# Altium project PCB_Project.PrjPcb
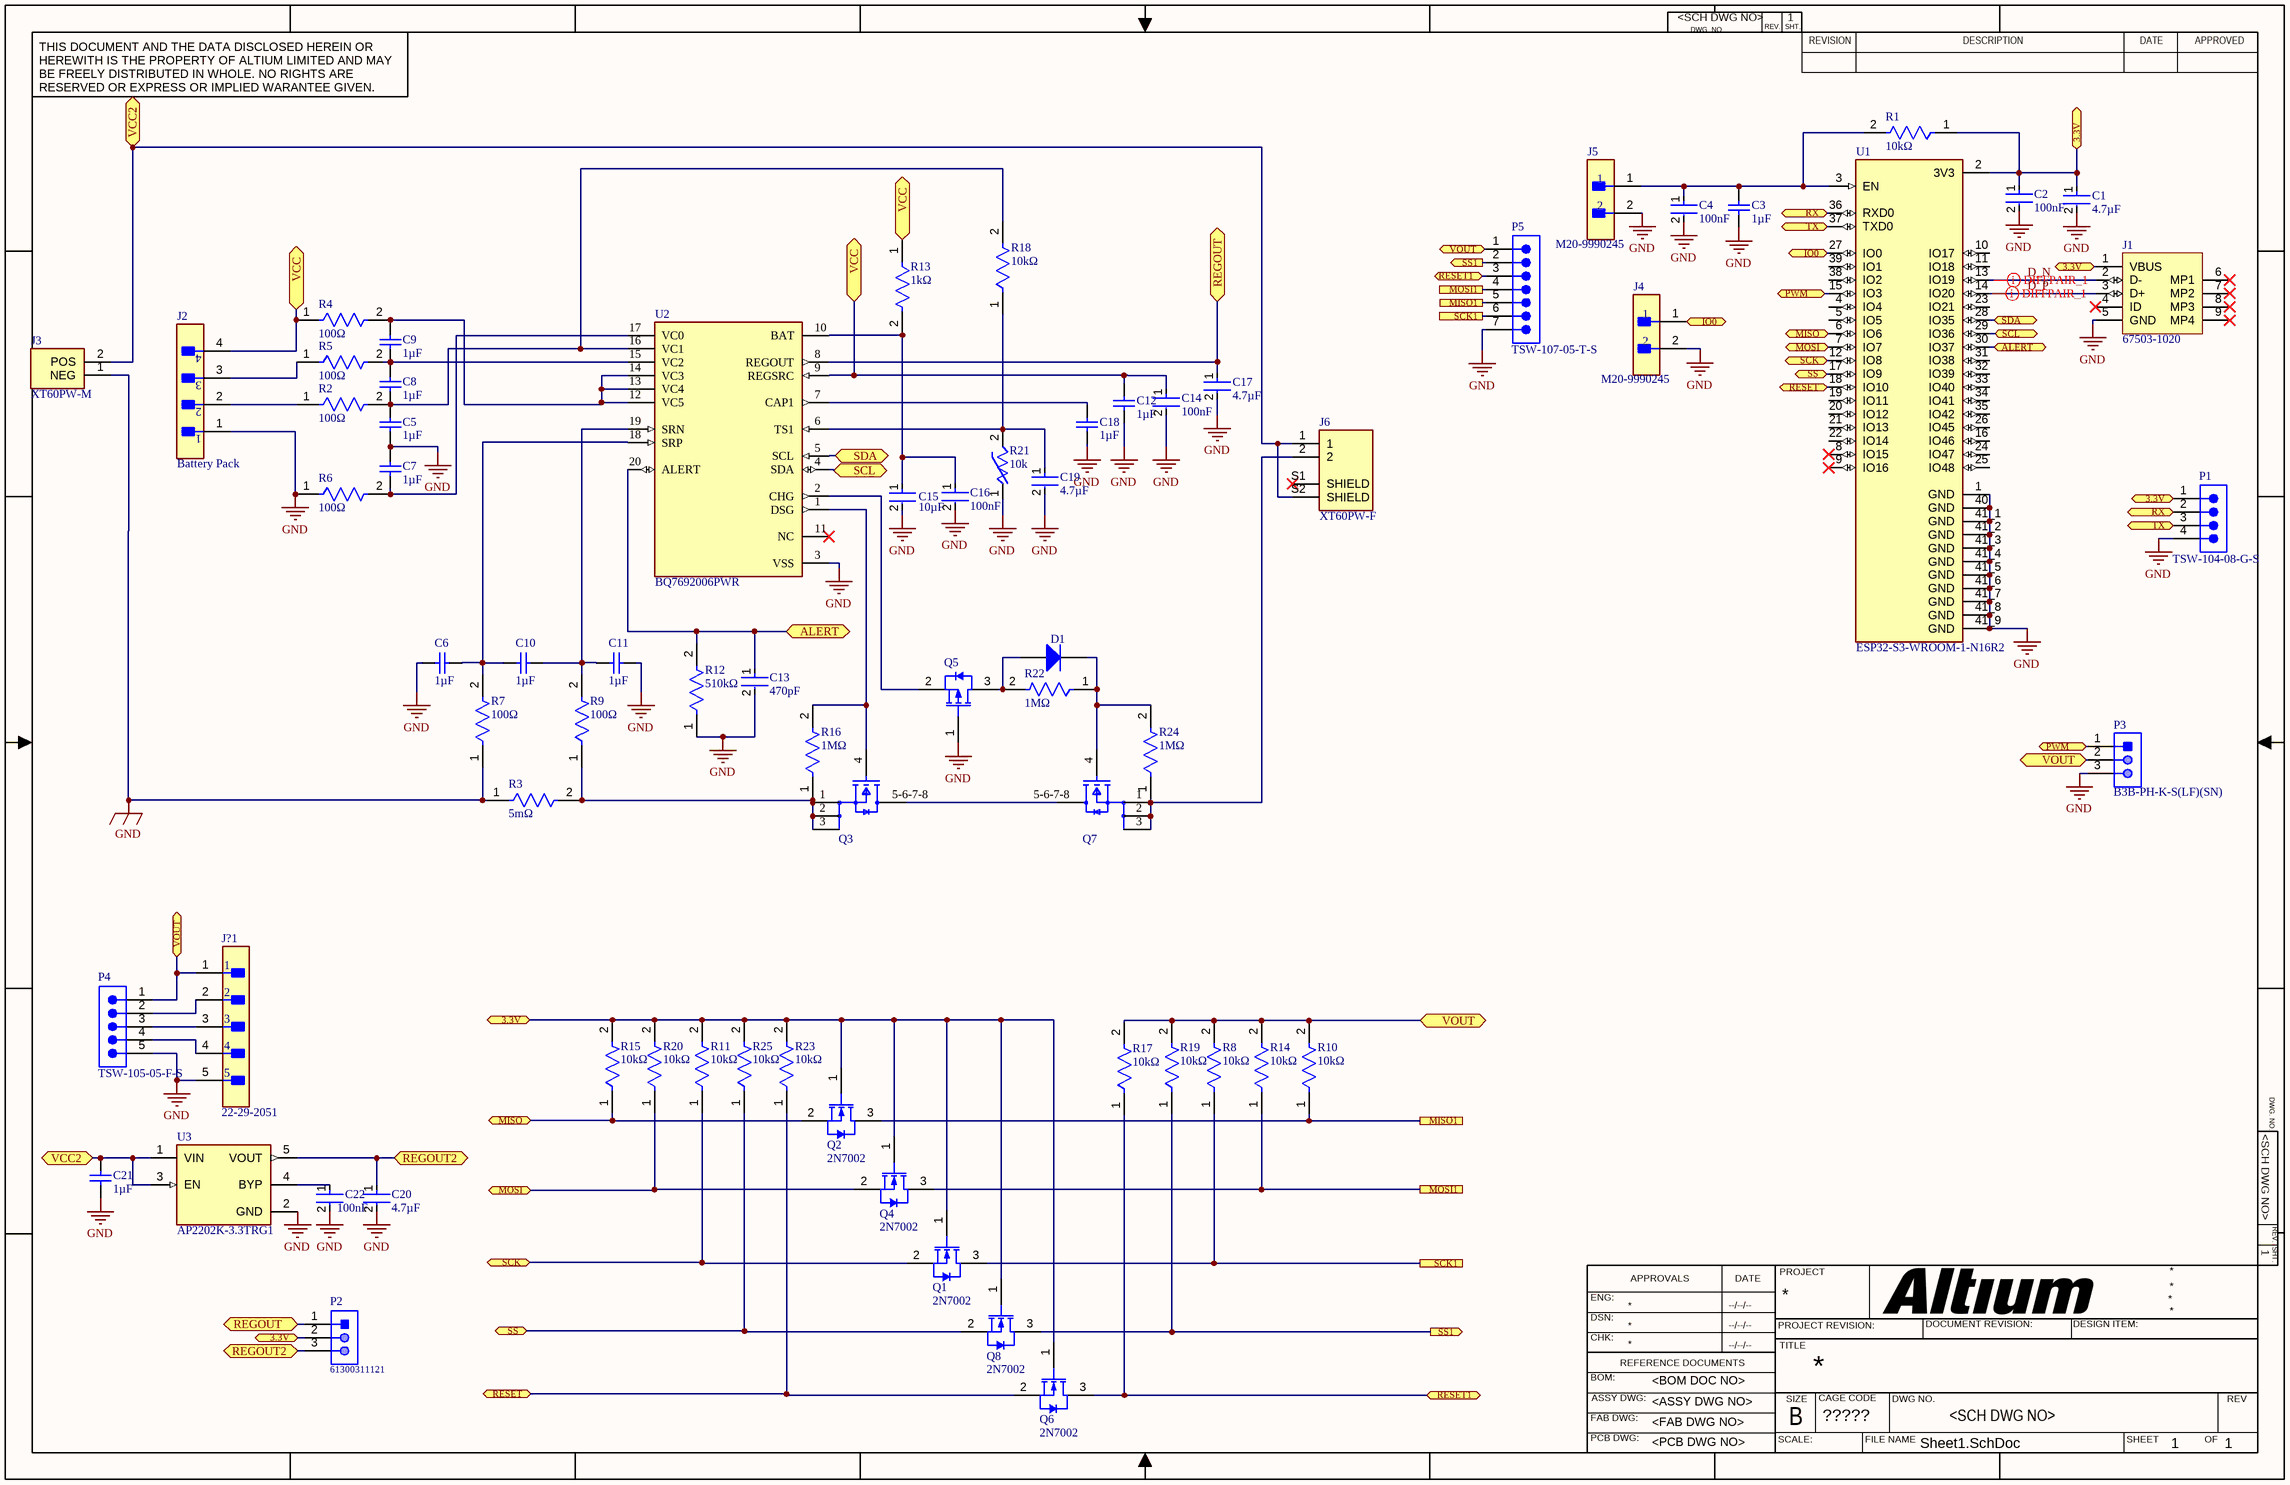
[diagram p0: Sheet1.SchDoc]
CAGE_CODE: ?????; CONTRACT_NUMBER: <CONTRACT NO>; DOC_NO_ASSY_DWG: <ASSY DWG NO>; DOC_NO_BOM: <BOM DOC NO>; DOC_NO_FAB_DWG: <FAB DWG NO>; DOC_NO_SCH_DWG: <SCH DWG NO>; PCB_2_DEC_TOL: +/-.01; PCB_3_DEC_TOL: +/-.010; PCB_ANG_TOL: +/-1/2; PCB_ASSEMBLY_NO: <PCB ASSY NO>; PCB_CHECKER: - -----; PCB_CHECKER_APP_DATE: --/--/----; PCB_DESIGNER: - -----; PCB_DESIGNER_APP_DATE: --/--/----; PCB_DWG_NO: <PCB DWG NO>; PCB_ENGINEER: - -----; PCB_ENGINEER_APP_DATE: --/--/----; PCB_PART_NUMBER: <PCB PN>; PCB_REV: A; SCH_REV: A
1 sheet, 71 parts. Net scope: flat (ports and power ports of the same name join across sheets).
Board file: PCB1.PcbDoc

## Sheet Sheet1.SchDoc
size 431 x 279 mm; SheetNumber: 1; SheetTotal: 1; ENG_APP_DATE: --/--/--; DSN_APP_DATE: --/--/--; CHK_APP_DATE: --/--/--

### Parts
C1  4.7µF  [FP-C2012-125-0_2-IPC_B]
C2  100nF  [FP-C0603C-CF-MFG]
C3  1µF  [CAPC1608X90X35LL10T15]
C4  100nF  [FP-C0603C-CF-MFG]
C5  1µF  [CAPC1608X90X35LL10T15]
C6  1µF  [CAPC1608X90X35LL10T15]
C7  1µF  [CAPC1608X90X35LL10T15]
C8  1µF  [CAPC1608X90X35LL10T15]
C9  1µF  [CAPC1608X90X35LL10T15]
C10  1µF  [CAPC1608X90X35LL10T15]
C11  1µF  [CAPC1608X90X35LL10T15]
C12  1µF  [CAPC1608X90X35LL10T15]
C13  470pF  [FP-C0603C-CF-MFG]
C14  100nF  [FP-C0603C-CF-MFG]
C15  10µF  [FP-GRM21B-0_15-IPC_C]
C16  100nF  [FP-C0603C-CF-MFG]
C17  4.7µF  [FP-C2012-125-0_2-IPC_B]
C18  1µF  [CAPC1608X90X35LL10T15]
C19  4.7µF  [FP-C2012-125-0_2-IPC_B]
C20  4.7µF  [FP-C2012-125-0_2-IPC_B]
C21  1µF  [CAPC1608X90X35LL10T15]
C22  100nF  [FP-C0603C-CF-MFG]
D1  1N4148WS-7-F  [DIOD-SOD323-2-A_V]  (value not drawn)
J1  67503-1020  [MOLX-67503-1020_V]
J2  Battery Pack  [FP-B4B-XH-A_LF_SN-MFG]
J3  XT60PW-M  [AMASS_XT60PW-M]
J4  M20-9990245  [FP-M20-9990245-MFG]
J5  M20-9990245  [FP-M20-9990245-MFG]
J6  XT60PW-F  [AMASS_XT60PW-F]
J?1  22-29-2051  [FP-22-29-2051-MFG]
P1  TSW-104-08-G-S  [SMTC-TSW-104-08-X-S]
P2  61300311121  [61300311121]
P3  B3B-PH-K-S(LF)(SN)  [JST-B3B-PH-K-S-3_V]
P4  TSW-105-05-F-S  [SMTC-TSW-105-05-X-S]
P5  TSW-107-05-T-S  [SMTC-TSW-107-05-X-S]
Q1  2N7002  [STM-SOT-23-3_V]
Q2  2N7002  [STM-SOT-23-3_V]
Q3  AON6362  [FP-DFN5x6_8L_EP1_P-MFG]  (value not drawn)
Q4  2N7002  [STM-SOT-23-3_V]
Q5  FDN338P  [FAIR-SSOT3L-3_V]  (value not drawn)
Q6  2N7002  [STM-SOT-23-3_V]
Q7  AON6362  [FP-DFN5x6_8L_EP1_P-MFG]  (value not drawn)
Q8  2N7002  [STM-SOT-23-3_V]
R1  10kΩ  [FP-CRCW0603-e3-MFG]
R2  100Ω  [FP-CRCW0603-e3-IPC_A]
R3  5mΩ  [FP-CRE2512-R005-R009-MFG]
R4  100Ω  [FP-CRCW0603-e3-IPC_A]
R5  100Ω  [FP-CRCW0603-e3-IPC_A]
R6  100Ω  [FP-CRCW0603-e3-IPC_A]
R7  100Ω  [FP-CRCW0603-e3-IPC_A]
R8  10kΩ  [FP-CRCW0603-e3-MFG]
R9  100Ω  [FP-CRCW0603-e3-IPC_A]
R10  10kΩ  [FP-CRCW0603-e3-MFG]
R11  10kΩ  [FP-CRCW0603-e3-MFG]
R12  510kΩ  [FP-CRCW0805-e3-IPC_B]
R13  1kΩ  [FP-CRCW0603-e3-MFG]
R14  10kΩ  [FP-CRCW0603-e3-MFG]
R15  10kΩ  [FP-CRCW0603-e3-MFG]
R16  1MΩ  [FP-CRCW0603-e3-MFG]
R17  10kΩ  [FP-CRCW0603-e3-MFG]
R18  10kΩ  [FP-CRCW0603-e3-MFG]
R19  10kΩ  [FP-CRCW0603-e3-MFG]
R20  10kΩ  [FP-CRCW0603-e3-MFG]
R21  10k  [ThermistorTHT]
R22  1MΩ  [FP-CRCW0603-e3-MFG]
R23  10kΩ  [FP-CRCW0603-e3-MFG]
R24  1MΩ  [FP-CRCW0603-e3-MFG]
R25  10kΩ  [FP-CRCW0603-e3-MFG]
U1  ESP32-S3-WROOM-1-N16R2  [XCVR_ESP32-S3-WROOM-1-N16R2]
U2  BQ7692006PWR  [FP-PW0020A-IPC_B]
U3  AP2202K-3.3TRG1  [FP-SOT25-MFG]

### Ports
3.3V (bidir), ALERT (bidir), IO0 (bidir), MISO1, MISO (bidir), MOSI1, MOSI (bidir), PWM (bidir), REGOUT2 (bidir), REGOUT (bidir), RESET1 (bidir), RESET (bidir), RX (bidir), SCK1, SCK (bidir), SCL (bidir), SDA (bidir), SS1 (out), SS (bidir), TX (bidir), VCC2 (bidir), VCC (bidir), VOUT (bidir)

### Nets
GND: C1.2 C2.2 C3.2 C4.2 C5.1 C6.2 C7.2 C11.1 C12.2 C13.2 C14.2 C15.2 C16.2 C17.2 C18.2 C19.2 C20.2 C21.2 C22.2 J1.5(GND) J2.1 J3.1(NEG) J4.2 J5.2 J?1.5 P1.4 P3.3 P4.5 P5.7 Q5.1(GATE) R3.1 R6.1 R7.1 R12.1 R21.1 U1.1(GND) U1.40(GND) U1.41_1(GND) U1.41_2(GND) U1.41_3(GND) U1.41_4(GND) U1.41_5(GND) U1.41_6(GND) U1.41_7(GND) U1.41_8(GND) U1.41_9(GND) U2.3(VSS) U3.2(GND)
D_N: J1.2(D-) U1.13(IO19)
D_P: J1.3(D+) U1.14(IO20)
NetC1_1: C1.1 C2.1 J1.1(VBUS) P1.1 P2.2 Q1.1(G) Q2.1(G) Q4.1(G) Q6.1(G) Q8.1(G) R1.1 R11.2 R15.2 R20.2 R23.2 R25.2 U1.2(3V3) ; port 3.3V
NetC3_1: C3.1 C4.1 J5.1 R1.2 U1.3(EN)
NetC5_2: C5.2 C8.1 R2.2 R18.2 U2.16(VC1)
NetC6_1: C6.1 C10.2 R7.2 U2.18(SRP)
NetC7_1: C7.1 R6.2 U2.17(VC0)
NetC8_2: C8.2 C9.1 R5.2 U2.15(VC2)
NetC9_2: C9.2 R4.2 U2.12(VC5) U2.13(VC4) U2.14(VC3)
NetC10_1: C10.1 C11.2 R9.2 U2.19(SRN)
NetC12_1: C12.1 C14.1 J2.4 R4.1 R13.1 U2.9(REGSRC) ; port VCC
NetC13_1: C13.1 R12.2 U1.30(IO37) U2.20(ALERT) ; port ALERT
NetC15_1: C15.1 C16.1 R13.2 U2.10(BAT)
NetC17_1: C17.1 P2.1 U2.8(REGOUT) ; port REGOUT
NetC18_1: C18.1 U2.7(CAP1)
NetC19_1: C19.1 R18.1 R21.2 U2.6(TS1)
NetC20_1: C20.1 P2.3 U3.5(VOUT) ; port REGOUT2
NetC21_1: C21.1 J3.2(POS) J6.1 J6.S2(SHIELD) U3.1(VIN) U3.3(EN) ; port VCC2
NetC22_1: C22.1 U3.4(BYP)
NetD1_1: D1.1(A) Q5.3(DRAIN) R22.2
NetD1_2: D1.2(K) Q7.4(G) R22.1 R24.2
NetJ2_2: J2.2 R2.1
NetJ2_3: J2.3 R5.1
NetJ4_1: J4.1 U1.27(IO0) ; port IO0
NetJ6_2: J6.2 Q7.1(S) Q7.2(S) Q7.3(S) R24.1
NetJ?1_1: J?1.1 P3.2 P4.1 P5.1 R8.2 R10.2 R14.2 R17.2 R19.2 ; port VOUT
NetJ?1_2: J?1.2 P4.2
NetJ?1_3: J?1.3 P4.3
NetJ?1_4: J?1.4 P4.4
NetP1_2: P1.2 U1.36(RXD0) ; port RX
NetP1_3: P1.3 U1.37(TXD0) ; port TX
NetP3_1: P3.1 U1.15(IO3) ; port PWM
NetP5_2: P5.2 Q8.3(D) R19.1 ; port SS1
NetP5_3: P5.3 Q6.3(D) R17.1 ; port RESET1
NetP5_4: P5.4 Q4.3(D) R14.1 ; port MOSI1
NetP5_5: P5.5 Q2.3(D) R10.1 ; port MISO1
NetP5_6: P5.6 Q1.3(D) R8.1 ; port SCK1
NetQ1_2: Q1.2(S) R11.1 U1.12(IO8) ; port SCK
NetQ2_2: Q2.2(S) R15.1 U1.6(IO6) ; port MISO
NetQ3_1: Q3.1(S) Q3.2(S) Q3.3(S) R3.2 R9.1 R16.1
NetQ3_4: Q3.4(G) R16.2 U2.1(DSG)
NetQ3_5-6-7-8: Q3.5-6-7-8(D) Q7.5-6-7-8(D)
NetQ4_2: Q4.2(S) R20.1 U1.7(IO7) ; port MOSI
NetQ5_2: Q5.2(SOURCE) U2.2(CHG)
NetQ6_2: Q6.2(S) R23.1 U1.18(IO10) ; port RESET
NetQ8_2: Q8.2(S) R25.1 U1.17(IO9) ; port SS
NetU1_28: U1.28(IO35) U2.5(SCL) ; port SDA
NetU1_29: U1.29(IO36) U2.4(SDA) ; port SCL

Not connected (* = marked no-connect by the designer): J1 4(ID)* 6(MP1)* 7(MP2)* 8(MP3)* 9(MP4)*; J6 S1(SHIELD)*; U1 4(IO4) 5(IO5) 8(IO15)* 9(IO16)* 10(IO17) 11(IO18) 16(IO46) 19(IO11) 20(IO12) 21(IO13) 22(IO14) 23(IO21) 24(IO47) 25(IO48) 26(IO45) 31(IO38) 32(IO39) 33(IO40) 34(IO41) 35(IO42) 38(IO2) 39(IO1); U2 11(NC)*

### Layout directives
differential pair; differential pair class diff; Parameter 1: true: D_N, D_P

### Notes on the sheet
- DWG. NO.
- REV.
- SHT.
- THIS DOCUMENT AND THE DATA DISCLOSED HEREIN OR HEREWITH IS THE PROPERTY OF ALTIUM LIMITED AND MAY BE FREELY DISTRIBUTED IN WHOLE. NO RIGHTS ARE RESERVED OR EXPRESS OR IMPLIED WARANTEE GIVEN.
- REVISION
- DESCRIPTION
- DATE
- APPROVED
- ENG:
- APPROVALS
- PROJECT
- DSN:
- CHK:
- REFERENCE DOCUMENTS
- PROJECT REVISION:
- TITLE
- DOCUMENT REVISION:
- DESIGN ITEM:
- BOM:
- FAB DWG:
- PCB DWG:
- ASSY DWG:
- SCALE:
- SIZE
- B
- CAGE CODE
- FILE NAME
- DWG NO.
- SHEET
- OF
- REV

### Library data of the parts
C1 C17 C19 C20 = CMP-08246-000007-2: Multilayer Ceramic Capacitors 4.7μF ±10% 50V X5R SMD 0805; Capacitance: 4.7uF; Case Code (Metric): 2012; Weight: 0.000194oz; Voltage Rating: 50V; Voltage: 50V; Construction: Flat; Series: C; Packaging: Tape and Reel; Height: 1.25mm; Depth: 1.25mm; Resistor Type: Ceramic; Width: 0.049inch; Length: 2mm; Thickness: 0.057inch; REACH SVHC: No SVHC; Max Operating Temperature: 85°C; Case/Package: 0805; Dielectric: X5R; Tolerance: 10%; Dielectric Material: Ceramic; Package Quantity: 1; Mount: Surface Mount; Radiation Hardening: No; Voltage Rating (DC): 50V; Case Code (Imperial): 0805; Termination: SMD/SMT; Min Operating Temperature: -55°C; Lead Free: Lead Free
C2 C4 C14 C16 C22 = CMP-2006-03061-2: CAP CER 0.1UF 50V X7R 0603; Manufacturer: KEMET; Manufacturer Part Number: C0603C104K5RACTU; Tolerance: 0.1; Temperature Coefficient: 30ppm/°C; Material: Ceramic; Automotive Grade: Grade 1; Value: 0.10 μF; Temperature: -55°C to +125°C; RoHS: TRUE; Temperature Range High: +125°C; Lead Free: Yes; Octopart: https://octopart.com/c0603c104k5ractu-kemet-139244; Digikey Description: CAP CER 0.1UF 50V X7R 0603; Category: Cap; Package: C0603C-CF; ComponentLink2Description: Datasheet; Temperature Range Low: -55°C; Device Class L1: Passive Components; Voltage Rating: 50 V; Automotive: Yes; Device Class L3: Ceramic Capacitors; ComponentLink2URL: https://api.kemet.com/component-edge/download/datasheet/C0603C100J5GACAUTO.pdf; Capacitance: 0.10 μF; Device Class L2: Capacitors; Temperature Characteristic: X7R; Height: 0.87mm
C3 C5-C12 C18 C21 = CMP-2006-02459-1: Manufacturer: Murata; Part Number: GRM188R61E105KA12D
C13 = CMP-2006-03816-2: CAP CER 470PF 50V X7R 0603; Manufacturer Part Number: C0603C471K5RACTU; Manufacturer: KEMET; Tolerance: 0.1; Temperature Coefficient: 30ppm/°C; Material: Ceramic; Automotive Grade: Grade 1; Capacitance: 470 pF; Temperature Characteristic: X7R; Mouser Description: Ceramic Capacitor, 470Pf, 50V, X7R, 10%, 0603, Full Reel; Height: 0.87mm; Temperature: -55°C to +125°C; RoHS: TRUE; Lead Free: Yes; Category: Cap; ComponentLink2URL: https://api.kemet.com/component-edge/download/datasheet/C0603C100J5GACAUTO.pdf; Device Class L3: Ceramic Capacitors; Temperature Range High: +125°C; Package: C0603C-CF; Automotive: Yes; Device Class L2: Capacitors; Device Class L1: Passive Components; Value: 470 pF; Digikey Description: CAP CER 470PF 50V X7R 0603; Temperature Range Low: -55°C; ComponentLink2Description: Datasheet; Voltage Rating: 50 V; Octopart: https://octopart.com/c0603c471k5ractu-kemet-89311
C15 = CMP-2007-03541-2: Chip Multilayer Ceramic Capacitors for General Purpose, 0805, 10uF, X5R, 15%, 10%, 25V; Length: 2mm; Depth: 1.25mm; Termination: SMD/SMT; Voltage: 25V; Height: 1.25mm; Material: Ceramic; Thickness: 0.053inch; Radiation Hardening: No; Min Operating Temperature: -55°C; Width: 0.049inch; Package Quantity: 1; Mount: Surface Mount; Dielectric: X5R; Packaging: Tape and Reel; Capacitance: 10uF; Voltage Rating (DC): 25V; Lead Free: Lead Free; Max Operating Temperature: 85°C; Case Code (Imperial): 0805; Case/Package: 0805; Tolerance: 10%; Voltage Rating: 25V; Case Code (Metric): 2012
D1 = CMP-1667-00004-1: Fast Switching Diode, 75 V, 0.3 A, -65 to 150 degC, 2-Pin SOD323, RoHS, Tape and Reel; DatasheetVersion: Rev. 25-2, 03/2016; PackageDescription: 2-Pin Small Outline Diode, Body 1.7 x 1.3 mm; ComponentLink2Description: Datasheet; ComponentLink1URL: http://www.diodes.com/; PackageReference: SOD323-2; ComponentLink2URL: http://www.diodes.com/datasheets/ds30097.pdf; ComponentLink1Description: Manufacturer URL
J1 = CMP-0411-00002-1: USB, MINI, SMD, RA KME04-USBMU03A01; Manufacturer: Molex; ComponentLink1URL: http://www.molex.com/; PartNumber: 67503-1020; Mounting Technology: Surface Mount; ComponentLink1Description: Manufacturer URL; Terminal Pitch: 0.8 mm; DatasheetVersion: Rev F, 06/2009; ComponentLink2Description: Datasheet; PackageDescription: Mini USB Connector, SMT, Righer Angle; ComponentLink2URL: http://www.molex.com/pdm_docs/sd/675031020_sd.pdf; PackageReference: 67503-1020
J2 = CMP-17439-000250-1: CONN HEADER VERT 4POS 2.5MM; Number of Contacts: 4; Contact Resistance: 20mR; Voltage Rating: 250V; Max Current Rating: 3A; Gender: Male; Wire/Cable Gauge: 22AWG; Mated Stacking Heights: 9.8mm; Insulation Resistance: 1GR; Orientation: Straight; Contact Type: Male Pin; Contact Finish - Mating: TIN; Series: XH; Max Voltage Rating (AC): 250V; Lead Pitch: 2.5mm; Contact Shape: Square; Insulation Color: Natural; Termination: Solder; Lead Free: Lead Free; Voltage Rating (AC): 250V; Number of Rows: 1; Flammability Rating: UL94 V-0; Number of Positions: 4; Max Operating Temperature: 85°C; Package Quantity: 500; Mount: Through Hole; REACH SVHC: No SVHC; Connector Type: Header; Insulation Material: Nylon; Fastening Type: Detent; Min Operating Temperature: -25°C; Housing Color: White; Packaging: Bulk; Contact Plating: Tin; Contact Material: Brass; Max Voltage Rating (DC): 250V; Housing Material: Polyamide; Color: Natural; Material: Polyamide; Pitch: 2.5mm; Depth: 5.75mm; Current Rating: 3A; Length: 12.4mm
J3 = XT60PW-M: Socket, DC supply, male, PIN: 2; MF: AMASS; Check_prices: https://www.snapeda.com/parts/XT60PW-M/AMASS/view-part/?ref=eda; Value: *; Availability: Not in stock; Package: Package; SnapEDA_Link: https://www.snapeda.com/parts/XT60PW-M/AMASS/view-part/?ref=snap; MP: XT60PW-M; Price: None
J4 J5 = CMP-15831-000105-1: CONN HEADER VERT 2POS 2.54MM; Working Voltage: 750V; Gender: Male; Number of Poles: 2; Current Rating: 3A; Mated Stacking Heights: 16.54mm; Contact Resistance: 25mR; Connector Type: Male Pin; Insulation Resistance: 10GR; Mating Cycles: 300; Voltage: 50V; Flammability Rating: UL94 V-0; Pitch: 2.54mm; Series: M20; Number of Contacts: 2; Height: 0.12inch; Min Operating Temperature: -40°C; Contact Finish - Mating: GOLD; Number of Positions: 2; Number of Rows: 1; Packaging: Bulk; Package Quantity: 1000; Voltage Rating (AC): 750V; Current: 3A; Mount: Through Hole; Case/Package: SIL; Orientation: Straight; Contact Shape: Square; Weight: 0.25lb; Radiation Hardening: No; Fastening Type: Pull; Length: 5.08mm; Depth: 2.54mm; Contact Mating Length: 0.24inch; Housing Material: Nylon; Reach SVHC Compliant: Yes; Insulation Material: Nylon; Color: Black; Width: 0.25inch; Insulation Color: Black; Contact Material: Brass; Contact Type: Male Pin; Termination: Solder; Max Operating Temperature: 105°C; Contact Plating: Gold; Housing Color: Black; Max Current Rating: 3A; Lead Pitch: 2.54mm
J6 = XT60PW-F: Socket DC Supply Connector Female; MF: AMASS; SnapEDA_Link: https://www.snapeda.com/parts/XT60PW-F/AMASS/view-part/?ref=snap; Package: Package; Availability: Not in stock; Price: None; Check_prices: https://www.snapeda.com/parts/XT60PW-F/AMASS/view-part/?ref=eda; MP: XT60PW-F; Value: *
J?1 = CMP-04776-000816-1: 2.54MM KK HDR VT FRICLK VRA .5AU; Number of Circuits: 5; Connector Type: Male Pin; Max Current Rating: 7A; Glow Wire Compliant: Non-compliant; Insulation Resistance: 50GR; Gender: Male; Current Rating: 4A; Number of Lines: 1; Max Voltage Rating (AC): 250V; Contact Resistance: 10mR; Orientation: Straight; Height: 14.73mm; Contact Plating: Gold; Series: KK® 6410; Number of Poles: 5; Mount: Through Hole; Length: 12.7mm; Packaging: Bulk; Package Quantity: 10; Depth: 5.8mm; Housing Color: White; Pitch: 2.54mm; Number of Positions: 5; Contact Mating Length: 0.295inch; Max Operating Temperature: 75°C; Housing Material: Nylon; Termination: Solder; Contact Material: Brass; Flammability Rating: UL94 V-0; Number of Contacts: 5; Color: Natural; Min Operating Temperature: 0°C; Radiation Hardening: No; Contact Type: Male Pin; Number of Rows: 1; Voltage Rating: 250V; Voltage Rating (DC): 250V; Contact Gender: Male; Fastening Type: Friction; Lead Free: Lead Free; Halogen Free: Low Halogen
P1 = CMP-1024-00357-1: 0.025" SQ Post Header, Through-hole, Vertical, -55 to 125 degC, 2.54 mm Pitch, 4-Pin, Male, RoHS; Manufacturer: Samtec; Pitch: 2.54 mm; RoHS: True; ComponentLink3URL: http://www.samtec.com/documents/webfiles/cpdf/TSW-XXX-XX-XXX-X-XX-XXX-MKT.pdf; Mounting Technology: Through-hole; ComponentLink2URL: http://www.samtec.com/documents/webfiles/pdf/TSW_TH.PDF; ComponentLink1URL: http://www.samtec.com; ComponentLink3Description: Package Specification; PackageVersion: DM, 8/1988; ComponentLink2Description: Datasheet; PackageReference: TSW-104-08-X-S; PackageDescription: .025[0.64] SQ. Post Terminal Strip Assembly; PartNumber: TSW-104-08-G-S; ComponentLink1Description: Manufacturer URL; Temperature Range: -55 to 125 degC; DatasheetVersion: F-214; Orientation: Vertical
P2 = CMP-1502-01062-1: THT Vertical Pin Header WR-PHD, Pitch 2.54 mm, Single Row, 3 pins; Manufacturer: Wurth Elektronik; Withstanding Voltage: 500VAC; Working Voltage: 250VAC; Rated Current: 3A; Pitch: 2.54mm; Pin Number: 3; Gender: Male; Contact Resistance: 20mOhm; Package Reference: 61300311121; Manufacturer URL: http://www.we-online.de; Datasheet URL: https://katalog.we-online.de/em/datasheet/6130xx11121.pdf; Operating Temperature: -40to105degC; Part Number: 61300311121; Orientation: Vertical; Packaging: Bag; Row Number: Single; Mounting Technology: THT; Publisher: WurthElektronik
P3 = CMP-2000-05164-1: Male Header, Pitch 2 mm, 1 x 3 Position, Height 6 mm, Tail Length 3.4 mm, -25 to 85 degC, RoHS, Bulk; Manufacturer: JST; Style/Orientation: StraightHeader/Plug; Pitch: 2mm; No of Positions: 3; Termination: Crimp; Manufacturer URL: http://www.jst.com/home2.html; Datasheet Version: Oct-06; Type: ShroudedHeader; Datasheet URL: https://datasheet.ciiva.com/11746/0900766b80826550-11746939.pdf
P4 = CMP-1024-00365-1: 0.025" SQ Post Header, Through-hole, Vertical, -55 to 125 degC, 2.54 mm Pitch, 5-Pin, Male, RoHS; Manufacturer: Samtec; Pitch: 2.54 mm; PackageReference: TSW-105-05-X-S; ComponentLink1Description: Manufacturer URL; Temperature Range: -55 to 125 degC; ComponentLink2Description: Datasheet; ComponentLink2URL: http://www.samtec.com/documents/webfiles/pdf/TSW_TH.PDF; PartNumber: TSW-105-05-F-S; ComponentLink3URL: http://www.samtec.com/documents/webfiles/cpdf/TSW-XXX-XX-XXX-X-XX-XXX-MKT.pdf; ComponentLink1URL: http://www.samtec.com; DatasheetVersion: F-214; Mounting Technology: Through-hole; RoHS: True; PackageVersion: DM, 8/1988; ComponentLink3Description: Package Specification; PackageDescription: .025[0.64] SQ. Post Terminal Strip Assembly; Orientation: Vertical
P5 = CMP-1024-00399-1: 0.025" SQ Post Header, Through-hole, Vertical, -55 to 105 degC, 2.54 mm Pitch, 7-Pin, Male, RoHS; Manufacturer: Samtec; Pitch: 2.54 mm; ComponentLink3URL: http://www.samtec.com/documents/webfiles/cpdf/TSW-XXX-XX-XXX-X-XX-XXX-MKT.pdf; ComponentLink1Description: Manufacturer URL; DatasheetVersion: F-214; RoHS: True; ComponentLink3Description: Package Specification; PartNumber: TSW-107-05-T-S; ComponentLink2Description: Datasheet; PackageDescription: .025[0.64] SQ. Post Terminal Strip Assembly; Orientation: Vertical; PackageVersion: DM, 8/1988; Mounting Technology: Through-hole; ComponentLink1URL: http://www.samtec.com; ComponentLink2URL: http://www.samtec.com/documents/webfiles/pdf/TSW_TH.PDF; PackageReference: TSW-107-05-X-S; Temperature Range: -55 to 105 degC
Q1 Q2 Q4 Q6 Q8 = CMP-0434-00001-1: N-channel 60 V, 1.8 Ohm, 0.35 A STripFET(TM) II Power MOSFET, SOT23; Manufacturer: STMicroelectronics; PartNumber: 2N7002; ComponentLink2Description: Datasheet; ComponentLink2URL: http://www.st.com/st-web-ui/static/active/en/resource/technical/document/datasheet/CD00005134.pdf; ComponentLink1Description: Manufacturer URL; ComponentLink1URL: http://www.st.com/; DatasheetVersion: Rev. 9, 11/2008; PackageReference: SOT-23; Mounting Technology: Surface Mount; PackageDescription: 3-Pin SOT23, 3.016 x 2.8 mm Body, 0.95 mm Pitch
Q3 Q7 = CMP-83955-000014-1: MOSFET N-CH 30V 27A/60A 8DFN; Continuous Drain Current (ID): 60A; Rds On Max: 5.2mR; Input Capacitance: 820pF; Max Power Dissipation: 6.2W; RoHS Compliant: Yes; Mount: Surface Mount; Min Operating Temperature: -55°C; Max Operating Temperature: 150°C; Drain to Source Voltage (Vdss): 30V; Packaging: Tape and Reel; Case/Package: DFN
Q5 = CMP-2000-06251-1: P-Channel Specified Power Trench(R) MOSFET, 2.5 V, -20 V, -1.6 A, -55 to 150 degC, 3-Pin SOT23, RoHS, Tape and Reel; Manufacturer: Fairchild Semiconductor; Current - Continuous Drain (Id) @ 25°C: 1.6A(Ta); Product Training Modules: HighVoltageSwitchesforPowerProcessingSMPSPowerSwitch; Gate Charge (Qg) @ Vgs: 6.2nC@4.5V; Package Version: Rev. 3, 05/2015; PCN Design/Specification: MoldCompound08/April/2008; Vgs(th) (Max) @ Id: 1.5V@250µA; FET Type: MOSFETP-Channel,MetalOxide; FET Feature: Standard; PCN Packaging: BinaryYearCodeMarking15/Jan/2014; Other Names: FDN338PTR; Online Catalog: P-ChannelLogicLevelGateFETs; Input Capacitance (Ciss) @ Vds: 451pF@10V; Rds On (Max) @ Id, Vgs: 115mOhm@1.6A,4.5V; Drain to Source Voltage (Vdss): 20V; Power - Max: 460mW; Datasheet Version: Rev. F1(W), 11/2013; Manufacturer URL: https://www.fairchildsemi.com/; Package Description: 3-Pin Small Outline Transistor, Body 2.92 x 1.4 mm, Pitch 0.95 mm; Datasheet URL: https://datasheet.ciiva.com/22655/1802191-22655335.pdf; Family: FETs-Single; Package URL: https://www.fairchildsemi.com/package-drawings/MA/MA03B.pdf; Package Reference: SSOT3L; Supplier Device Package: 3-SSOT; Standard Package: 3,000; Package / Case: TO-236-3,SC-59,SOT-23-3; Mounting Technology: SurfaceMount; Series: PowerTrench®; Mounting Type: SurfaceMount; Packaging: Tape&Reel(TR); Category: DiscreteSemiconductorProducts
R1 R8 R10 R11 R14 R15 R17-R20 R23 R25 = CMP-2000-03838-2: RES Thick Film, 10kΩ, 5%, 0.1W, 200ppm/°C, 0603; Max Power Dissipation: 100mW; Voltage Rating: 75V; Resistance: 10kR; Termination: SMD/SMT; Depth: 0.85mm; Weight: 7.1E-05oz; Military Standard: Not; Case Code (Imperial): 0603; Lead Free: Lead Free; Features: Automotive AEC-Q200; Tolerance: 5%; Case Code (Metric): 1608; Package Quantity: 1; Radiation Hardening: No; Number of Terminations: 2; Max Operating Temperature: 155°C; Min Operating Temperature: -55°C; Composition: Thick Film; Number of Pins: 2; Height: 0.02inch; Contact Plating: Tin; Temperature Coefficient: 200ppm/°C; Width: 0.033inch; Packaging: Tape and Reel; Length: 1.55mm; Mount: Surface Mount; Voltage Rating (DC): 75V; Case/Package: 0603; Power Rating: 100mW
R2 R4-R7 R9 = CMP-2000-03825-2: RES Thick Film, 100Ω, 1%, 0.1W, 100ppm/°C, 0603; Voltage Rating (DC): 75V; Power Rating: 100mW; Resistance: 100R; Case Code (Imperial): 0603; Case/Package: 0603; Composition: Thick Film; Military Standard: Not; Number of Terminations: 2; Packaging: Tape and Reel; Depth: 0.85mm; Height: 0.02inch; Features: Automotive AEC-Q200; Width: 0.033inch; Lead Free: Lead Free; Contact Plating: Tin; Package Quantity: 10000; Length: 1.55mm; Tolerance: 1%; Temperature Coefficient: 100ppm/°C; Max Operating Temperature: 155°C; Weight: 7.1E-05oz; Voltage Rating: 75V; Radiation Hardening: No; Max Power Dissipation: 100mW; Termination: SMD/SMT; Min Operating Temperature: -55°C; Case Code (Metric): 1608
R3 = CMP-07231-006697-1: RES 0.005 OHM 1% 3W 2512; Resistance: 5mR; Temperature Coefficient: 75ppm/°C; Termination: Solder; Width: 0.132inch; Case Code (Imperial): 2512; Max Power Dissipation: 3W; Height: 0.035inch; Mount: Surface Mount; Contact Plating: Tin; Resistor Type: Metal Film; Packaging: Cut Tape; Max Operating Temperature: 170°C; Features: Moisture Resistant; REACH SVHC: No SVHC; Case Code (Metric): 6432; Depth: 3.35mm; Case/Package: 2512; Min Operating Temperature: -55°C; Tolerance: 1%; Power Rating: 3W; Length: 0.254inch; Number of Terminations: 2
R12 = CMP-2001-03987-2: RES Thick Film, 510kΩ, 1%, 0.125W, 100ppm/°C, 0805; Power Rating: 125mW; Voltage Rating (DC): 150V; Resistance: 510kR; Length: 2mm; Min Operating Temperature: -55°C; Package Quantity: 10; Tolerance: 1%; Width: 1.25mm; Contact Plating: Tin; Mount: Surface Mount; Voltage Rating: 150V; Temperature Coefficient: 100ppm/°C; Radiation Hardening: No; Case/Package: 0805; Max Power Dissipation: 125mW; Military Standard: Not; Case Code (Imperial): 0805; Lead Free: Lead Free; Height: 0.45mm; Termination: SMD/SMT; Packaging: Tape and Reel; Depth: 1.25mm; Features: Automotive AEC-Q200; Weight: 0.000194oz; Max Operating Temperature: 155°C; Composition: Thick Film; Case Code (Metric): 2012; Number of Pins: 2; Number of Terminations: 2
R13 = CMP-1666-00003-5: RES Thick Film, 1kΩ, 1%, 0.1W, 100ppm/°C, 0603; Max Power Dissipation: 100mW; Voltage Rating: 75V; Resistance: 1kR; Max Operating Temperature: 155°C; Number of Pins: 2; Case Code (Imperial): 0603; Width: 0.033inch; Power Rating: 100mW; Number of Terminations: 2; Package Quantity: 10; Weight: 7.1E-05oz; Tolerance: 1%; Temperature Coefficient: 100ppm/°C; Military Standard: Not; Mount: Surface Mount; Voltage Rating (DC): 75V; Depth: 0.85mm; Composition: Thick Film; Radiation Hardening: No; Termination: SMD/SMT; Length: 1.55mm; Case Code (Metric): 1608; Contact Plating: Tin; Min Operating Temperature: -55°C; Packaging: Tape and Reel; Height: 0.45mm; Lead Free: Lead Free; Case/Package: 0603; Features: Automotive AEC-Q200
R16 R22 R24 = CMP-2000-03013-2: RES Thick Film, 1MΩ, 1%, 0.1W, 100ppm/°C, 0603; Max Power Dissipation: 100mW; Resistance: 1MR; Voltage Rating (DC): 75V; Depth: 0.85mm; Max Operating Temperature: 155°C; Length: 1.55mm; Power Rating: 100mW; Military Standard: Not; Features: Automotive AEC-Q200; Min Operating Temperature: -55°C; Number of Pins: 2; Mount: Surface Mount; Package Quantity: 10; Packaging: Tape and Reel; Height: 0.45mm; Radiation Hardening: No; Case Code (Metric): 1608; Temperature Coefficient: 100ppm/°C; Width: 0.85mm; Composition: Thick Film; Termination: SMD/SMT; Tolerance: 1%; Number of Terminations: 2; Lead Free: Lead Free; Contact Plating: Tin; Case/Package: 0603; Weight: 7.1E-05oz; Voltage Rating: 75V; Case Code (Imperial): 0603
R21 = NTCLE100E3104JB0: Thermistor NTC 100K Ohm 5% 2-Pin Radial 4190K -5 to -4.5 Bulk; Manufacturer: Vishay BCcomponents; Resistance: 100kR; Max Power Dissipation: 500mW; Accuracy: 1.5%; Lead Diameter: 0.6mm; Lead Length: 17mm; Supplier 1: Mouser; Manufacturer Part Number: NTCLE100E3104JB0; RoHS: Yes; Category: Thermistors; Stock 1: 20929; Pricing 1: 1=0,89000, 10=0,73400, 50=0,73400, 100=0,45600, 1000=0,34600, 10000=0,28400 (USD); Mount: Through Hole; Case/Package: Radial; Number of Pins: 2; Min Operating Temperature: -40°C; Max Operating Temperature: 125°C; Tolerance: 5%; Packaging: Bulk; Package Quantity: 500; Termination: Radial; Series: 2322; Resistance Tolerance: 5%; Length: 3.3mm; Height: 9mm; Depth: 3mm; Lead Pitch: 2.54mm; Radiation Hardening: No; RoHS Compliant: Yes; Lead Free: Lead Free; ComponentLink1URL: https://datasheet.ciiva.com/15097/getdatasheetpartid-129697-15097699.pdf?src-supplier=Verical; ComponentLink1Description: https://datasheet.ciiva.com/15097/getdatasheetpartid-129697-15097699.pdf?src-supplier=Verical; ComponentLink2URL: https://datasheet.ciiva.com/7659/1784420-7659488.pdf?src-supplier=Element14; ComponentLink2Description: https://datasheet.ciiva.com/7659/1784420-7659488.pdf?src-supplier=Element14; ComponentLink3URL: https://datasheet.ciiva.com/2851/ntcle100-2851268.pdf?src-supplier=Digi-Key; ComponentLink3Description: https://datasheet.ciiva.com/2851/ntcle100-2851268.pdf?src-supplier=Digi-Key; ComponentLink4URL: https://datasheet.ciiva.com/2848/ntcle100-2848931.pdf?src-supplier=Digi-Key; ComponentLink4Description: https://datasheet.ciiva.com/2848/ntcle100-2848931.pdf?src-supplier=Digi-Key; ComponentLink5URL: https://datasheet.ciiva.com/3280/ntcle100-3280361.pdf?src-supplier=Avnet; ComponentLink5Description: https://datasheet.ciiva.com/3280/ntcle100-3280361.pdf?src-supplier=Avnet; ComponentLink6URL: https://datasheet.ciiva.com/2851/ntcle100-2851261.pdf?src-supplier=Digi-Key; ComponentLink6Description: https://datasheet.ciiva.com/2851/ntcle100-2851261.pdf?src-supplier=Digi-Key; Supplier Part Number 1: 594-2381-640-63104
U1 = ESP32-S3-WROOM-1-N16R2: Bluetooth, WiFi 802.11b/g/n, Bluetooth v5.0 Transceiver Module 2.4GHz PCB Trace Surface Mount; MF: Espressif Systems; Package: None; Availability: In Stock; SnapEDA_Link: https://www.snapeda.com/parts/ESP32-S3-WROOM-1-N16R2/Espressif+Systems/view-part/?ref=snap; MP: ESP32-S3-WROOM-1-N16R2; Value: *; Purchase-URL: https://pricing.snapeda.com/search/part/ESP32-S3-WROOM-1-N16R2/?ref=eda; Price: None; Check_prices: https://www.snapeda.com/parts/ESP32-S3-WROOM-1-N16R2/Espressif+Systems/view-part/?ref=eda
U2 = CMP-04911-000072-1: IC BATT MON MULTI 3-5C 20TSSOP; Output Voltage: 3.6V; Operating Supply Voltage: 25V; Interface: I2C; Fault Protection: Over Current; RoHS Compliant: Yes; Min Operating Temperature: -40°C; Weight: 0.002758oz; Mount: Surface Mount; Packaging: Tape and Reel; Package Quantity: 2000; Number of Pins: 20; Case/Package: TSSOP; Max Operating Temperature: 85°C; Contact Plating: Gold; Lead Free: Lead Free
U3 = CMP-12756-000010-1: IC REG LINEAR 3.3V 150MA SOT23-5; Manufacturer: Diodes Inc.; Max Junction Temp: +125°C; Max Supply Voltage: 13.2V; Standoff Height: 0.013mm; Dropout Voltage: 165mV; Nominal Supply Current: 95-1300uA; Accuracy Percentage: 1%; Min Supply Voltage: 2.5V; Output Type: Fixed; Number Of Outputs: 1; RoHS: TRUE; Category: IC; Digikey Description: IC REG LINEAR 3.3V 150MA SOT23-5; ComponentLink2URL: https://www.diodes.com/assets/Datasheets/AP2202.pdf; Manufacturer Part Number: AP2202K-3.3TRG1; Lead Free: Yes; Octopart: https://octopart.com/ap2202k-3.3trg1-diodes+inc.-30954618; ComponentLink2Description: Datasheet; Temperature Range High: +125°C; Ipc Land Pattern Name: SOT95P280X115-5; Mouser Description: LDO Voltage Regulators 150mA CMOS LDO 3.3V; Temperature: -40°C to +125°C; Output Current: 150mA; Package: SOT25; Automotive: No; Temperature Range Low: -40°C; Height: 1.4mm; Device Class L2: Power Management ICs; Device Class L3: Voltage Regulators - Linear; Device Class L1: Integrated Circuits (ICs); Output Voltage: 3.3V; Footprint Url: https://www.diodes.com/assets/Package-Files/SOT25.pdf